# Altium schematic sheet PiAndServos.SchDoc (part 2 of 5)
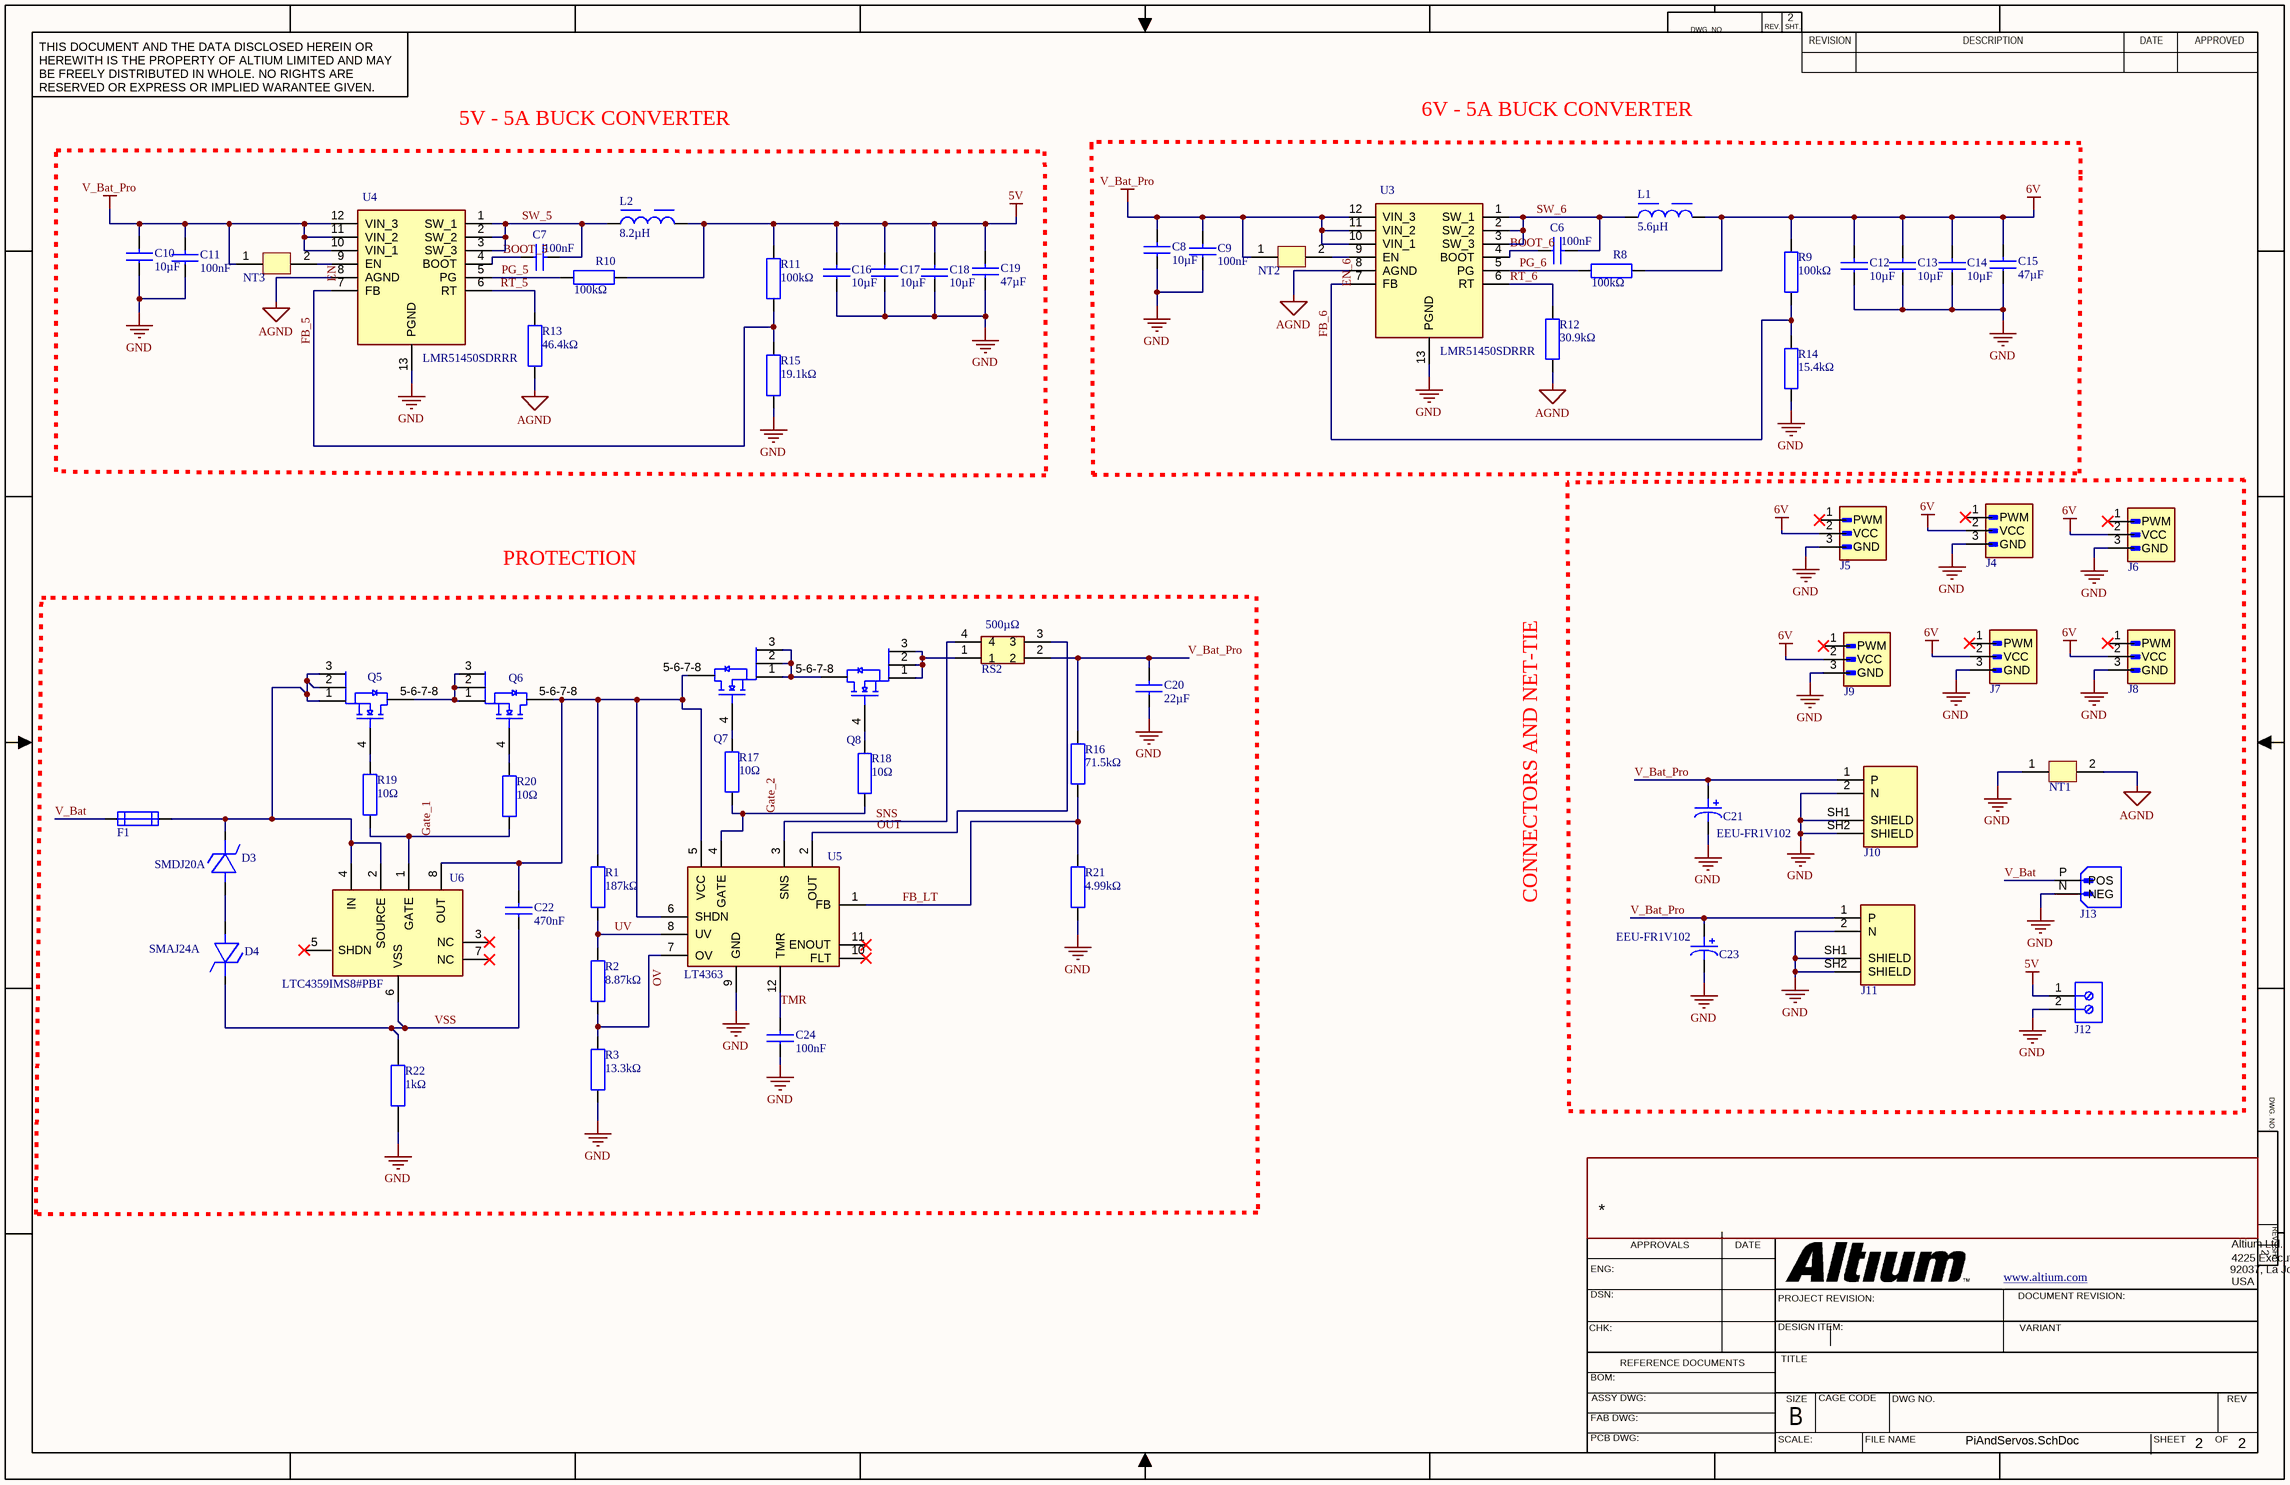
[diagram p1: PiAndServos.SchDoc]
## Library data of the parts
C6 C7 C24 = GRM155R71C104KA88D: 16V 100nF X7R ±10% 0402 Multilayer Ceramic Capacitors MLCC - SMD/SMT ROHS; Manufacturer: Murata; Manufacturer Lifecycle Status: NRND; Insulation Resistance: 10GΩ; Supplier: Future Electronics; Supplier Part Number: GRM155R71C104KA88D; Manufacturer Part Number: GRM155R71C104KA88D; RoHS: Compliant; Category: Ceramic Capacitors; Stock: 9240000; Pricing: 20000=0,001, 50000=0,001, 200000=0,0009, 500000=0,0009, 1250000=0,0009 (USD); Case/Package: 0402; Case Code (Imperial): 0402; Case Code (Metric): 1005; Country of Origin: Japan, Mainland China, Philippines, Singapore, Thailand; Depth: 500µm; Dielectric: X7R; Dielectric Material: Ceramic; Export Control Classification Number (ECCN) Code: EAR99; Height: 500µm; Harmonized Tariff Schedule (HTS) Code: 8532.24.00.20; Introduction Date: 2004-11-19; Lead Free: Lead Free; Length: 1mm; Lifecycle Status: NRND; Material: Ceramic; Max Operating Temperature: 125°C; Min Operating Temperature: -55°C; Mounting Technology: Surface Mount; Pins: 2; Number of Terminals: 2; Packaging: Cut Tape; Radiation Hardening: No; REACH SVHC: Yes; Schedule B: 8532240020, 8532240020|8532240020|8532240020|8532240020|8532240020|8532240020|8532240020|8532240020|8532240020|8532240020|8532240020|8532240020|8532240020, 8532240020|8532240020|8532240020|8532240020|8532240020|8532240020|8532240020|8532240020|8532240020|8532240020|8532240020|8532240020|8532240020|8532240020, 8532240020|8532240020|8532240020|8532240020|8532240020|8532240020|8532240020|8532240020|8532240020|8532240020|8532240020|8532240020|8532240020|8532240020|8532240020; Termination: SMD/SMT; Thickness: 500µm; Tolerance: 10%; Voltage: 16V; Voltage Rating: 16V; Voltage Rating (DC): 16V; Width: 500µm; ComponentLink1URL: https://datasheet.octopart.com:443/GRM155R71C104KA88D-Murata-datasheet-6387203.pdf?src-supplier=Upverter; ComponentLink1Description: https://datasheet.octopart.com:443/GRM155R71C104KA88D-Murata-datasheet-6387203.pdf?src-supplier=Upverter; ComponentLink2URL: https://datasheet.octopart.com:443/GRM155R71C104KA88D-Murata-datasheet-501912.pdf?src-supplier=Farnell; ComponentLink2Description: https://datasheet.octopart.com:443/GRM155R71C104KA88D-Murata-datasheet-501912.pdf?src-supplier=Farnell; ComponentLink3URL: https://datasheet.octopart.com:443/GRM155R71C104KA88D-Murata-datasheet-62320226.pdf?src-supplier=Farnell; ComponentLink3Description: https://datasheet.octopart.com:443/GRM155R71C104KA88D-Murata-datasheet-62320226.pdf?src-supplier=Farnell; ComponentLink4URL: https://datasheet.octopart.com:443/GRM155R71C104KA88D-Murata-datasheet-514334.pdf?src-supplier=Farnell; ComponentLink4Description: https://datasheet.octopart.com:443/GRM155R71C104KA88D-Murata-datasheet-514334.pdf?src-supplier=Farnell; ComponentLink5URL: https://datasheet.octopart.com:443/GRM155R71C104KA88D-Murata-datasheet-165579666.pdf?src-supplier=TME; ComponentLink5Description: https://datasheet.octopart.com:443/GRM155R71C104KA88D-Murata-datasheet-165579666.pdf?src-supplier=TME; ComponentLink6URL: https://datasheet.octopart.com:443/GRM155R71C104KA88D-Murata-datasheet-81455578.pdf?src-supplier=TME; ComponentLink6Description: https://datasheet.octopart.com:443/GRM155R71C104KA88D-Murata-datasheet-81455578.pdf?src-supplier=TME; ComponentLink7URL: https://datasheet.octopart.com:443/GRM155R71C104KA88D-Murata-datasheet-59876780.pdf?src-supplier=TME; ComponentLink7Description: https://datasheet.octopart.com:443/GRM155R71C104KA88D-Murata-datasheet-59876780.pdf?src-supplier=TME; ComponentLink8URL: https://datasheet.octopart.com:443/GRM155R71C104KA88D-Murata-datasheet-141266224.pdf?src-supplier=Ciiva; ComponentLink8Description: https://datasheet.octopart.com:443/GRM155R71C104KA88D-Murata-datasheet-141266224.pdf?src-supplier=Ciiva; ComponentLink9URL: https://datasheet.octopart.com:443/GRM155R71C104KA88D-Murata-datasheet-140690972.pdf?src-supplier=Ciiva; ComponentLink9Description: https://datasheet.octopart.com:443/GRM155R71C104KA88D-Murata-datasheet-140690972.pdf?src-supplier=Ciiva; ComponentLink10URL: https://datasheet.octopart.com:443/GRM155R71C104KA88D-Murata-datasheet-138740890.pdf?src-supplier=Ciiva; ComponentLink10Description: https://datasheet.octopart.com:443/GRM155R71C104KA88D-Murata-datasheet-138740890.pdf?src-supplier=Ciiva; ComponentLink11URL: https://datasheet.octopart.com:443/GRM155R71C104KA88D-Murata-datasheet-120101189.pdf?src-supplier=Megastar; ComponentLink11Description: https://datasheet.octopart.com:443/GRM155R71C104KA88D-Murata-datasheet-120101189.pdf?src-supplier=Megastar; ComponentLink12URL: https://datasheet.octopart.com:443/GRM155R71C104KA88D-Murata-datasheet-96971104.pdf?src-supplier=Future+Electronics; ComponentLink12Description: https://datasheet.octopart.com:443/GRM155R71C104KA88D-Murata-datasheet-96971104.pdf?src-supplier=Future+Electronics; ComponentLink13URL: https://datasheet.octopart.com:443/GRM155R71C104KA88D-Murata-datasheet-22122223.pdf?src-supplier=Future+Electronics; ComponentLink13Description: https://datasheet.octopart.com:443/GRM155R71C104KA88D-Murata-datasheet-22122223.pdf?src-supplier=Future+Electronics; ComponentLink14URL: https://datasheet.octopart.com:443/GRM155R71C104KA88D-Murata-datasheet-14400564.pdf?src-supplier=Future+Electronics; ComponentLink14Description: https://datasheet.octopart.com:443/GRM155R71C104KA88D-Murata-datasheet-14400564.pdf?src-supplier=Future+Electronics; ComponentLink15URL: https://datasheet.octopart.com:443/GRM155R71C104KA88D-Murata-datasheet-44106293.pdf?src-supplier=Future+Electronics; ComponentLink15Description: https://datasheet.octopart.com:443/GRM155R71C104KA88D-Murata-datasheet-44106293.pdf?src-supplier=Future+Electronics; ComponentLink16URL: https://datasheet.octopart.com/GRM155R71C104KA88D-Murata-datasheet-12515295.pdf; ComponentLink16Description: https://datasheet.octopart.com/GRM155R71C104KA88D-Murata-datasheet-12515295.pdf; ComponentLink17URL: https://datasheet.octopart.com/GRM155R71C104KA88D-Murata-datasheet-12510076.pdf; ComponentLink17Description: https://datasheet.octopart.com/GRM155R71C104KA88D-Murata-datasheet-12510076.pdf; ComponentLink18URL: https://datasheet.octopart.com/GRM155R71C104KA88D-Murata-datasheet-11978611.pdf; ComponentLink18Description: https://datasheet.octopart.com/GRM155R71C104KA88D-Murata-datasheet-11978611.pdf; ComponentLink19URL: https://datasheet.octopart.com/GRM155R71C104KA88D-Murata-datasheet-10025737.pdf; ComponentLink19Description: https://datasheet.octopart.com/GRM155R71C104KA88D-Murata-datasheet-10025737.pdf; ComponentLink20URL: https://datasheet.octopart.com/GRM155R71C104KA88D-Murata-datasheet-8819587.pdf; ComponentLink20Description: https://datasheet.octopart.com/GRM155R71C104KA88D-Murata-datasheet-8819587.pdf; ComponentLink21URL: https://datasheet.octopart.com/GRM155R71C104KA88D-Murata-datasheet-12555248.pdf; ComponentLink21Description: https://datasheet.octopart.com/GRM155R71C104KA88D-Murata-datasheet-12555248.pdf; ComponentLink22URL: https://datasheet.octopart.com:443/GRM155R71C104KA88D-Murata-datasheet-11864723.pdf?src-supplier=Arrow+Electronics; ComponentLink22Description: https://datasheet.octopart.com:443/GRM155R71C104KA88D-Murata-datasheet-11864723.pdf?src-supplier=Arrow+Electronics; ComponentLink23URL: https://datasheet.octopart.com:443/GRM155R71C104KA88D-Murata-datasheet-148211.pdf?src-supplier=Garrett; ComponentLink23Description: https://datasheet.octopart.com:443/GRM155R71C104KA88D-Murata-datasheet-148211.pdf?src-supplier=Garrett; ComponentLink24URL: https://datasheet.octopart.com:443/GRM155R71C104KA88D-Murata-datasheet-118811.pdf?src-supplier=DigiKey; ComponentLink24Description: https://datasheet.octopart.com:443/GRM155R71C104KA88D-Murata-datasheet-118811.pdf?src-supplier=DigiKey; ComponentLink25URL: https://datasheet.octopart.com:443/GRM155R71C104KA88D-Murata-datasheet-38265814.pdf?src-supplier=Newark; ComponentLink25Description: https://datasheet.octopart.com:443/GRM155R71C104KA88D-Murata-datasheet-38265814.pdf?src-supplier=Newark; ComponentLink26URL: http://sigma.octopart.com:80/reach_statement/Murata-company-16.pdf?src-supplier=Compliance+Statements; ComponentLink26Description: http://sigma.octopart.com:80/reach_statement/Murata-company-16.pdf?src-supplier=Compliance+Statements
C8 C10 C12-C14 C16-C18 = C3225X7R1H106M250AC: 50V 10uF X7R 卤20% 1210 Multilayer Ceramic Capacitors MLCC - SMD/SMT ROHS; Manufacturer: TDK; Manufacturer Lifecycle Status: PRODUCTION (NOT RECOMMENDED FOR NEW DESIGN); Manufacturer Package Identifier: 1210 (3225 Metric); Tolerance: 20%; Supplier: Arrow Electronics; Supplier Part Number: C3225X7R1H106M250AC; Manufacturer Part Number: C3225X7R1H106M250AC; RoHS: Compliant; Category: Ceramic Capacitors; Stock: 2290; Pricing: 1=0,9803, 10=0,4861, 100=0,4422, 500=0,3574, 1000=0,338, 2000=0,3166 (USD); Case/Package: 1210; Case Code (Imperial): 1210; Case Code (Metric): 3225; China RoHS: Compliant; Country of Origin: Japan; Dielectric: X7R; Dielectric Material: Ceramic; Export Control Classification Number (ECCN) Code: EAR99; Height: 2.5mm; Harmonized Tariff Schedule (HTS) Code: 8532.24.00.20; Introduction Date: 2013-02-27; Lead Free: Lead Free; Length: 3.2mm; Lifecycle Status: NRND; Material: Ceramic; Max Length: 3.6mm; Max Operating Temperature: 125°C; Max Width: 2.8mm; Min Length: 2.8mm; Min Operating Temperature: -55°C; Min Width: 2.2mm; Mounting Technology: Surface Mount; Number of Terminals: 2; REACH SVHC: Yes; Schedule B: 8532240020, 8532240020|8532240020|8532240020|8532240020|8532240020; Termination: SMD/SMT; Voltage Rating: 50V; Voltage Rating (DC): 50V; Weight: 15.989131mg; Width: 2.5mm; ComponentLink1URL: https://datasheet.octopart.com:443/C3225X7R1H106M250AC-TDK-datasheet-175423548.pdf?src-supplier=IHS; ComponentLink1Description: https://datasheet.octopart.com:443/C3225X7R1H106M250AC-TDK-datasheet-175423548.pdf?src-supplier=IHS; ComponentLink2URL: https://sigma.octopart.com:443/138898468/technical_drawing/TDK-C3225X7R1H106M250AC.pdf?src-supplier=Upverter; ComponentLink2Description: https://sigma.octopart.com:443/138898468/technical_drawing/TDK-C3225X7R1H106M250AC.pdf?src-supplier=Upverter; ComponentLink3URL: https://datasheet.octopart.com:443/C3225X7R1H106M250AC-TDK-datasheet-151546523.pdf?src-supplier=TDK; ComponentLink3Description: https://datasheet.octopart.com:443/C3225X7R1H106M250AC-TDK-datasheet-151546523.pdf?src-supplier=TDK; ComponentLink4URL: https://datasheet.octopart.com/C3225X7R1H106M250AC-TDK-datasheet-41194876.pdf; ComponentLink4Description: https://datasheet.octopart.com/C3225X7R1H106M250AC-TDK-datasheet-41194876.pdf; ComponentLink5URL: https://datasheet.octopart.com/C-Series-Ceramic-Chip-Capacitors-TDK-datasheet-family-84.pdf; ComponentLink5Description: https://datasheet.octopart.com/C-Series-Ceramic-Chip-Capacitors-TDK-datasheet-family-84.pdf; ComponentLink6URL: https://datasheet.octopart.com:443/C3225X7R1H106M250AC-TDK-datasheet-82475248.pdf?src-supplier=Newark; ComponentLink6Description: https://datasheet.octopart.com:443/C3225X7R1H106M250AC-TDK-datasheet-82475248.pdf?src-supplier=Newark; ComponentLink7URL: https://datasheet.octopart.com:443/C3225X7R1H106M250AC-TDK-datasheet-14433597.pdf?src-supplier=Future+Electronics; ComponentLink7Description: https://datasheet.octopart.com:443/C3225X7R1H106M250AC-TDK-datasheet-14433597.pdf?src-supplier=Future+Electronics; ComponentLink8URL: http://sigma.octopart.com:80/rohs_certificate/C-Series-Ceramic-Chip-Capacitors-TDK-family-108.pdf?src-supplier=Compliance+Statements; ComponentLink8Description: http://sigma.octopart.com:80/rohs_certificate/C-Series-Ceramic-Chip-Capacitors-TDK-family-108.pdf?src-supplier=Compliance+Statements
C9 C11 = CC0603KRX7R9BB104: Multilayer Ceramic Capacitor, CC Series, 0.1 - F, - 10%, X7R, 50 V, 0603 [1608 Metric]; Manufacturer: Yageo Group; Voltage: 50V; Supplier: Farnell; Supplier Part Number: CC0603KRX7R9BB104; Manufacturer Part Number: CC0603KRX7R9BB104; RoHS: Compliant; Category: Ceramic Capacitors; Stock: 1011406; Pricing: 10=0,0259, 100=0,0121, 500=0,0113, 1000=0,0104, 2000=0,0089, 4000=0,0073 (EUR); Case/Package: 0603; Case Code (Imperial): 0603; Case Code (Metric): 1608; China RoHS: Compliant; Country of Origin: Mainland China, Taiwan; Depth: 800µm; Dielectric: X7R; Dielectric Material: Ceramic; Export Control Classification Number (ECCN) Code: EAR99; Halogen Free: Halogen Free; Height: 800µm; Harmonized Tariff Schedule (HTS) Code: 8532.24.00.20; Introduction Date: 2005-08-18; Lead Free: Lead Free; Length: 1.6mm; Lifecycle Status: Production; Material: Ceramic; Max Operating Temperature: 125°C; Min Operating Temperature: -55°C; Mounting Technology: Surface Mount; Pins: 2; Number of Terminals: 2; Radiation Hardening: No; REACH SVHC: Yes; Schedule B: 8532240020, 8532240020|8532240020, 8532240020|8532240020|8532240020, 8532240020|8532240020|8532240020|8532240020; Termination: SMD/SMT; Thickness: 889µm; Tolerance: 10%; Voltage Rating: 50V; Voltage Rating (DC): 50V; Width: 800µm; ComponentLink1URL: https://datasheet.octopart.com:443/CC0603KRX7R9BB104-Yageo-datasheet-177165144.pdf?src-supplier=IHS; ComponentLink1Description: https://datasheet.octopart.com:443/CC0603KRX7R9BB104-Yageo-datasheet-177165144.pdf?src-supplier=IHS; ComponentLink2URL: https://datasheet.octopart.com:443/CC0603KRX7R9BB104-Yageo-datasheet-82288757.pdf?src-supplier=Upverter; ComponentLink2Description: https://datasheet.octopart.com:443/CC0603KRX7R9BB104-Yageo-datasheet-82288757.pdf?src-supplier=Upverter; ComponentLink3URL: https://datasheet.octopart.com:443/CC0603KRX7R9BB104-Yageo-datasheet-68298032.pdf?src-supplier=Upverter; ComponentLink3Description: https://datasheet.octopart.com:443/CC0603KRX7R9BB104-Yageo-datasheet-68298032.pdf?src-supplier=Upverter; ComponentLink4URL: https://datasheet.octopart.com:443/CC0603KRX7R9BB104-Yageo-Group-datasheet-189192896.pdf?src-supplier=Future+Electronics; ComponentLink4Description: https://datasheet.octopart.com:443/CC0603KRX7R9BB104-Yageo-Group-datasheet-189192896.pdf?src-supplier=Future+Electronics; ComponentLink5URL: https://datasheet.octopart.com:443/CC0603KRX7R9BB104-Yageo-datasheet-166511530.pdf?src-supplier=Future+Electronics; ComponentLink5Description: https://datasheet.octopart.com:443/CC0603KRX7R9BB104-Yageo-datasheet-166511530.pdf?src-supplier=Future+Electronics; ComponentLink6URL: https://datasheet.octopart.com:443/CC0603KRX7R9BB104-Yageo-datasheet-137700082.pdf?src-supplier=Future+Electronics; ComponentLink6Description: https://datasheet.octopart.com:443/CC0603KRX7R9BB104-Yageo-datasheet-137700082.pdf?src-supplier=Future+Electronics; ComponentLink7URL: https://datasheet.octopart.com:443/CC0603KRX7R9BB104-Yageo-datasheet-137700084.pdf?src-supplier=Future+Electronics; ComponentLink7Description: https://datasheet.octopart.com:443/CC0603KRX7R9BB104-Yageo-datasheet-137700084.pdf?src-supplier=Future+Electronics; ComponentLink8URL: https://datasheet.octopart.com:443/CC0603KRX7R9BB104-Yageo-datasheet-27626582.pdf?src-supplier=Future+Electronics; ComponentLink8Description: https://datasheet.octopart.com:443/CC0603KRX7R9BB104-Yageo-datasheet-27626582.pdf?src-supplier=Future+Electronics; ComponentLink9URL: https://datasheet.octopart.com:443/CC0603KRX7R9BB104-Yageo-datasheet-15895757.pdf?src-supplier=Future+Electronics; ComponentLink9Description: https://datasheet.octopart.com:443/CC0603KRX7R9BB104-Yageo-datasheet-15895757.pdf?src-supplier=Future+Electronics; ComponentLink10URL: https://datasheet.octopart.com:443/CC0603KRX7R9BB104-Yageo-datasheet-8324192.pdf?src-supplier=Future+Electronics; ComponentLink10Description: https://datasheet.octopart.com:443/CC0603KRX7R9BB104-Yageo-datasheet-8324192.pdf?src-supplier=Future+Electronics; ComponentLink11URL: https://datasheet.octopart.com/CC0603KRX7R9BB104-Yageo-datasheet-10883670.pdf; ComponentLink11Description: https://datasheet.octopart.com/CC0603KRX7R9BB104-Yageo-datasheet-10883670.pdf; ComponentLink12URL: https://datasheet.octopart.com/CC0603KRX7R9BB104-Yageo-datasheet-12526321.pdf; ComponentLink12Description: https://datasheet.octopart.com/CC0603KRX7R9BB104-Yageo-datasheet-12526321.pdf; ComponentLink13URL: https://datasheet.octopart.com:443/CC0603KRX7R9BB104-Yageo-datasheet-181968726.pdf?src-supplier=Newark; ComponentLink13Description: https://datasheet.octopart.com:443/CC0603KRX7R9BB104-Yageo-datasheet-181968726.pdf?src-supplier=Newark; ComponentLink14URL: https://datasheet.octopart.com:443/CC0603KRX7R9BB104-Yageo-datasheet-499490.pdf?src-supplier=Newark; ComponentLink14Description: https://datasheet.octopart.com:443/CC0603KRX7R9BB104-Yageo-datasheet-499490.pdf?src-supplier=Newark; ComponentLink15URL: https://datasheet.octopart.com:443/CC0603KRX7R9BB104-Yageo-datasheet-62336348.pdf?src-supplier=Newark; ComponentLink15Description: https://datasheet.octopart.com:443/CC0603KRX7R9BB104-Yageo-datasheet-62336348.pdf?src-supplier=Newark; ComponentLink16URL: https://datasheet.octopart.com:443/CC0603KRX7R9BB104-Yageo-datasheet-147453679.pdf?src-supplier=Newark; ComponentLink16Description: https://datasheet.octopart.com:443/CC0603KRX7R9BB104-Yageo-datasheet-147453679.pdf?src-supplier=Newark; ComponentLink17URL: https://datasheet.octopart.com:443/CC0603KRX7R9BB104-Yageo-datasheet-151948686.pdf?src-supplier=Farnell; ComponentLink17Description: https://datasheet.octopart.com:443/CC0603KRX7R9BB104-Yageo-datasheet-151948686.pdf?src-supplier=Farnell; ComponentLink18URL: https://datasheet.octopart.com:443/CC0603KRX7R9BB104-Yageo-datasheet-500777.pdf?src-supplier=Farnell; ComponentLink18Description: https://datasheet.octopart.com:443/CC0603KRX7R9BB104-Yageo-datasheet-500777.pdf?src-supplier=Farnell; ComponentLink19URL: https://datasheet.octopart.com:443/CC0603KRX7R9BB104-Yageo-datasheet-178019014.pdf?src-supplier=Burklin+Elektronik; ComponentLink19Description: https://datasheet.octopart.com:443/CC0603KRX7R9BB104-Yageo-datasheet-178019014.pdf?src-supplier=Burklin+Elektronik; ComponentLink20URL: https://datasheet.octopart.com:443/CC0603KRX7R9BB104-Yageo-Group-datasheet-165992755.pdf?src-supplier=ODG+(Origin+Data+Global); ComponentLink20Description: https://datasheet.octopart.com:443/CC0603KRX7R9BB104-Yageo-Group-datasheet-165992755.pdf?src-supplier=ODG+(Origin+Data+Global); ComponentLink21URL: https://datasheet.octopart.com:443/CC0603KRX7R9BB104-Yageo-datasheet-140260305.pdf?src-supplier=SOS+electronic; ComponentLink21Description: https://datasheet.octopart.com:443/CC0603KRX7R9BB104-Yageo-datasheet-140260305.pdf?src-supplier=SOS+electronic; ComponentLink22URL: https://datasheet.octopart.com:443/CC0603KRX7R9BB104-Yageo-datasheet-120101875.pdf?src-supplier=Megastar; ComponentLink22Description: https://datasheet.octopart.com:443/CC0603KRX7R9BB104-Yageo-datasheet-120101875.pdf?src-supplier=Megastar; ComponentLink23URL: https://datasheet.octopart.com:443/CC0603KRX7R9BB104-Yageo-datasheet-8701427.pdf?src-supplier=element14; ComponentLink23Description: https://datasheet.octopart.com:443/CC0603KRX7R9BB104-Yageo-datasheet-8701427.pdf?src-supplier=element14; ComponentLink24URL: https://datasheet.octopart.com:443/CC0603KRX7R9BB104-Yageo-datasheet-5301394.pdf?src-supplier=element14; ComponentLink24Description: https://datasheet.octopart.com:443/CC0603KRX7R9BB104-Yageo-datasheet-5301394.pdf?src-supplier=element14; ComponentLink25URL: https://datasheet.octopart.com:443/CC0603KRX7R9BB104-Yageo-datasheet-17600895.pdf?src-supplier=TME; ComponentLink25Description: https://datasheet.octopart.com:443/CC0603KRX7R9BB104-Yageo-datasheet-17600895.pdf?src-supplier=TME; ComponentLink26URL: http://sigma.octopart.com:80/15889575/rohs_statement/Yageo-CC0603KRX7R9BB104.pdf?src-supplier=Compliance+Statements; ComponentLink26Description: http://sigma.octopart.com:80/15889575/rohs_statement/Yageo-CC0603KRX7R9BB104.pdf?src-supplier=Compliance+Statements; ComponentLink27URL: http://sigma.octopart.com:80/rohs_statement/Surface-Mount-Ceramic-Multilayer-Capacitors%3B-General-Purpose-%26-High-Capacitance-Class-2%2C-X7R-Yageo-family-124.pdf?src-supplier=Compliance+Statements; ComponentLink27Description: http://sigma.octopart.com:80/rohs_statement/Surface-Mount-Ceramic-Multilayer-Capacitors%3B-General-Purpose-%26-High-Capacitance-Class-2%2C-X7R-Yageo-family-124.pdf?src-supplier=Compliance+Statements; ComponentLink28URL: http://sigma.octopart.com:80/reach_statement/Surface-Mount-Ceramic-Multilayer-Capacitors%3B-General-Purpose-%26-High-Capacitance-Class-2%2C-X7R-Yageo-family-125.pdf?src-supplier=Compliance+Statements; ComponentLink28Description: http://sigma.octopart.com:80/reach_statement/Surface-Mount-Ceramic-Multilayer-Capacitors%3B-General-Purpose-%26-High-Capacitance-Class-2%2C-X7R-Yageo-family-125.pdf?src-supplier=Compliance+Statements; ComponentLink29URL: http://sigma.octopart.com:80/conflict_mineral_statement/Yageo-company-3.pdf?src-supplier=Compliance+Statements; ComponentLink29Description: http://sigma.octopart.com:80/conflict_mineral_statement/Yageo-company-3.pdf?src-supplier=Compliance+Statements
C15 C19 = GRM32ER61C476KE15L: 16V 47uF X5R ±10% 1210 Multilayer Ceramic Capacitors MLCC - SMD/SMT ROHS; Manufacturer: Murata; Manufacturer Lifecycle Status: NRND; Manufacturer Package Identifier: 1210 (3225 Metric); Supplier: Future Electronics; Supplier Part Number: GRM32ER61C476KE15L; Manufacturer Part Number: GRM32ER61C476KE15L; RoHS: Compliant; Category: Ceramic Capacitors; Stock: 188000; Pricing: 1000=0,0948, 3000=0,0921, 4000=0,0914, 10000=0,0893, 15000=0,0872 (USD); Case/Package: 1210; Case Code (Imperial): 1210; Case Code (Metric): 3225; Depth: 2.5mm; Dielectric: X5R; Dielectric Material: Ceramic; Height: 2.5mm; Lead Free: Lead Free; Length: 3.2mm; Lifecycle Status: NRND; Material: Ceramic; Max Operating Temperature: 85°C; Min Operating Temperature: -55°C; Mounting Technology: Surface Mount; Pins: 2; Number of Terminals: 2; Radiation Hardening: No; REACH SVHC: Yes; Schedule B: 8532240020, 8532240020|8532240020, 8532240020|8532240020|8532240020, 8532240020|8532240020|8532240020|8532240020; Termination: SMD/SMT; Thickness: 2.5mm; Tolerance: 10%; Voltage: 16V; Voltage Rating: 16V; Voltage Rating (DC): 16V; Width: 2.5mm; ComponentLink1URL: https://datasheet.octopart.com:443/GRM32ER61C476KE15L-Murata-datasheet-11893327.pdf?src-supplier=_legacy+Avnet; ComponentLink1Description: https://datasheet.octopart.com:443/GRM32ER61C476KE15L-Murata-datasheet-11893327.pdf?src-supplier=_legacy+Avnet; ComponentLink2URL: https://datasheet.octopart.com:443/GRM32ER61C476KE15L-Murata-datasheet-62317406.pdf?src-supplier=element14+APAC; ComponentLink2Description: https://datasheet.octopart.com:443/GRM32ER61C476KE15L-Murata-datasheet-62317406.pdf?src-supplier=element14+APAC; ComponentLink3URL: https://datasheet.octopart.com:443/GRM32ER61C476KE15L-Murata-datasheet-17853190.pdf?src-supplier=element14+APAC; ComponentLink3Description: https://datasheet.octopart.com:443/GRM32ER61C476KE15L-Murata-datasheet-17853190.pdf?src-supplier=element14+APAC; ComponentLink4URL: https://datasheet.octopart.com:443/GRM32ER61C476KE15L-Murata-datasheet-8817987.pdf?src-supplier=Newark; ComponentLink4Description: https://datasheet.octopart.com:443/GRM32ER61C476KE15L-Murata-datasheet-8817987.pdf?src-supplier=Newark; ComponentLink5URL: https://datasheet.octopart.com:443/GRM32ER61C476KE15L-Murata-datasheet-14403028.pdf?src-supplier=Future+Electronics; ComponentLink5Description: https://datasheet.octopart.com:443/GRM32ER61C476KE15L-Murata-datasheet-14403028.pdf?src-supplier=Future+Electronics; ComponentLink6URL: https://datasheet.octopart.com:443/GRM32ER61C476KE15L-Murata-datasheet-22122223.pdf?src-supplier=Future+Electronics; ComponentLink6Description: https://datasheet.octopart.com:443/GRM32ER61C476KE15L-Murata-datasheet-22122223.pdf?src-supplier=Future+Electronics; ComponentLink7URL: https://datasheet.octopart.com:443/GRM32ER61C476KE15L-Murata-datasheet-44109711.pdf?src-supplier=Future+Electronics; ComponentLink7Description: https://datasheet.octopart.com:443/GRM32ER61C476KE15L-Murata-datasheet-44109711.pdf?src-supplier=Future+Electronics; ComponentLink8URL: https://datasheet.octopart.com:443/GRM32ER61C476KE15L-Murata-datasheet-165579666.pdf?src-supplier=TME; ComponentLink8Description: https://datasheet.octopart.com:443/GRM32ER61C476KE15L-Murata-datasheet-165579666.pdf?src-supplier=TME; ComponentLink9URL: https://datasheet.octopart.com:443/GRM32ER61C476KE15L-Murata-datasheet-59876780.pdf?src-supplier=TME; ComponentLink9Description: https://datasheet.octopart.com:443/GRM32ER61C476KE15L-Murata-datasheet-59876780.pdf?src-supplier=TME; ComponentLink10URL: https://datasheet.octopart.com:443/GRM32ER61C476KE15L-Murata-datasheet-140709622.pdf?src-supplier=Ciiva; ComponentLink10Description: https://datasheet.octopart.com:443/GRM32ER61C476KE15L-Murata-datasheet-140709622.pdf?src-supplier=Ciiva; ComponentLink11URL: https://datasheet.octopart.com:443/GRM32ER61C476KE15L-Murata-datasheet-138747025.pdf?src-supplier=Ciiva; ComponentLink11Description: https://datasheet.octopart.com:443/GRM32ER61C476KE15L-Murata-datasheet-138747025.pdf?src-supplier=Ciiva; ComponentLink12URL: https://datasheet.octopart.com:443/GRM32ER61C476KE15L-Murata-datasheet-102370999.pdf?src-supplier=HQonline; ComponentLink12Description: https://datasheet.octopart.com:443/GRM32ER61C476KE15L-Murata-datasheet-102370999.pdf?src-supplier=HQonline; ComponentLink13URL: https://datasheet.octopart.com:443/GRM32ER61C476KE15L-Murata-datasheet-14047368.pdf?src-supplier=iiiC; ComponentLink13Description: https://datasheet.octopart.com:443/GRM32ER61C476KE15L-Murata-datasheet-14047368.pdf?src-supplier=iiiC; ComponentLink14URL: https://datasheet.octopart.com/GRM32ER61C476KE15L-Murata-datasheet-12515295.pdf; ComponentLink14Description: https://datasheet.octopart.com/GRM32ER61C476KE15L-Murata-datasheet-12515295.pdf; ComponentLink15URL: https://datasheet.octopart.com/GRM32ER61C476KE15L-Murata-datasheet-12510076.pdf; ComponentLink15Description: https://datasheet.octopart.com/GRM32ER61C476KE15L-Murata-datasheet-12510076.pdf; ComponentLink16URL: https://datasheet.octopart.com/GRM32ER61C476KE15L-Murata-datasheet-11978611.pdf; ComponentLink16Description: https://datasheet.octopart.com/GRM32ER61C476KE15L-Murata-datasheet-11978611.pdf; ComponentLink17URL: https://datasheet.octopart.com/GRM32ER61C476KE15L-Murata-datasheet-10025737.pdf; ComponentLink17Description: https://datasheet.octopart.com/GRM32ER61C476KE15L-Murata-datasheet-10025737.pdf; ComponentLink18URL: https://datasheet.octopart.com/GRM32ER61C476KE15L-Murata-datasheet-8819587.pdf; ComponentLink18Description: https://datasheet.octopart.com/GRM32ER61C476KE15L-Murata-datasheet-8819587.pdf; ComponentLink19URL: https://datasheet.octopart.com:443/GRM32ER61C476KE15L.-Murata-datasheet-5332913.pdf?src-supplier=Farnell; ComponentLink19Description: https://datasheet.octopart.com:443/GRM32ER61C476KE15L.-Murata-datasheet-5332913.pdf?src-supplier=Farnell; ComponentLink20URL: http://sigma.octopart.com:80/reach_statement/Murata-company-16.pdf?src-supplier=Compliance+Statements; ComponentLink20Description: http://sigma.octopart.com:80/reach_statement/Murata-company-16.pdf?src-supplier=Compliance+Statements
C20 = C5750X7R1H226M250KB: 50V 22uF X7R 卤20% 2220 Multilayer Ceramic Capacitors MLCC - SMD/SMT ROHS; Manufacturer: TDK; Manufacturer Lifecycle Status: PRODUCTION; Tolerance: 20%; Supplier: Farnell; Supplier Part Number: C5750X7R1H226M250KB; Manufacturer Part Number: C5750X7R1H226M250KB; RoHS: Compliant; Category: Ceramic Capacitors; Stock: 4; Pricing: 1=3,8, 10=2,29, 50=2,23, 100=2,16, 200=2,06, 500=1,96 (EUR); Case/Package: 2220; Case Code (Metric): 5750; China RoHS: Compliant; Dielectric: X7R; Dielectric Material: Ceramic; Export Control Classification Number (ECCN) Code: EAR99; Height: 2.5mm; Harmonized Tariff Schedule (HTS) Code: 8532.24.00.20; Introduction Date: 2019-03-19; Lead Free: Lead Free; Length: 5.7mm; Lifecycle Status: Production; Material: Ceramic; Max Length: 6.1mm; Max Operating Temperature: 125°C; Max Width: 5.4mm; Min Length: 5.3mm; Min Operating Temperature: -55°C; Min Width: 4.6mm; Mounting Technology: Surface Mount; Number of Terminals: 2; REACH SVHC: Yes; Thickness: 2.5mm; Voltage Rating: 50V; Voltage Rating (DC): 50V; Width: 5mm; ComponentLink1URL: https://datasheet.octopart.com:443/C5750X7R1H226M250KB-TDK-datasheet-175423548.pdf?src-supplier=TME; ComponentLink1Description: https://datasheet.octopart.com:443/C5750X7R1H226M250KB-TDK-datasheet-175423548.pdf?src-supplier=TME; ComponentLink2URL: https://datasheet.octopart.com:443/C5750X7R1H226M250KB-TDK-datasheet-68298673.pdf?src-supplier=Upverter; ComponentLink2Description: https://datasheet.octopart.com:443/C5750X7R1H226M250KB-TDK-datasheet-68298673.pdf?src-supplier=Upverter; ComponentLink3URL: https://datasheet.octopart.com:443/C5750X7R1H226M250KB-TDK-datasheet-151546523.pdf?src-supplier=ODG+(Origin+Data+Global); ComponentLink3Description: https://datasheet.octopart.com:443/C5750X7R1H226M250KB-TDK-datasheet-151546523.pdf?src-supplier=ODG+(Origin+Data+Global); ComponentLink4URL: https://datasheet.octopart.com:443/C5750X7R1H226M250KB-TDK-datasheet-154546117.pdf?src-supplier=Farnell; ComponentLink4Description: https://datasheet.octopart.com:443/C5750X7R1H226M250KB-TDK-datasheet-154546117.pdf?src-supplier=Farnell; ComponentLink5URL: https://datasheet.octopart.com/C5750X7R1H226M250KB-TDK-datasheet-41194876.pdf; ComponentLink5Description: https://datasheet.octopart.com/C5750X7R1H226M250KB-TDK-datasheet-41194876.pdf; ComponentLink6URL: https://datasheet.octopart.com/C-Series-Ceramic-Chip-Capacitors-TDK-datasheet-family-84.pdf; ComponentLink6Description: https://datasheet.octopart.com/C-Series-Ceramic-Chip-Capacitors-TDK-datasheet-family-84.pdf; ComponentLink7URL: http://sigma.octopart.com:80/rohs_certificate/C-Series-Ceramic-Chip-Capacitors-TDK-family-108.pdf?src-supplier=Compliance+Statements; ComponentLink7Description: http://sigma.octopart.com:80/rohs_certificate/C-Series-Ceramic-Chip-Capacitors-TDK-family-108.pdf?src-supplier=Compliance+Statements
C21 C23 = EEU-FR1V102: Radial Can ALUMINUM ELECTROLYTIC CAPACITOR FR 35V 1000muF ±20% 0.492Dia 12.50mm; Manufacturer: Panasonic; Manufacturer Part Number: EEUFR1V102; Manufacturer Lifecycle Status: ACTIVE; Part Series: FR-A; Value: 1mF; Dissipation Factor: 12%; ESR (Equivalent Series Resistance): 18mΩ; Lead/Base Style: Straight; Lead Diameter: 600µm; Leakage Current: 350µA; Life (Hours): 10000hours; Polarity: Polar; Ripple Current: 2.6A; Supplier: Farnell; Supplier Part Number: EEUFR1V102; RoHS: Compliant; Category: Aluminum Electrolytic Capacitors; Stock: 26228; Pricing: 1=1,24, 5=0,838, 10=0,55, 25=0,533, 50=0,517, 200=0,5 (EUR); Case/Package: Radial; Contact Plating: Tin; Country of Origin: Malaysia; Diameter: 12.5mm; Export Control Classification Number (ECCN) Code: EAR99; Height: 22mm; Height - Seated (Max): 21.9964mm; Harmonized Tariff Schedule (HTS) Code: 8532.22.00.20; Impedance: 18mΩ; Introduction Date: 2010-12-07; Lead Free: Lead Free; Lead Pitch: 5mm; Length: 20mm; Lifecycle Status: Production; Max Operating Temperature: 105°C; Min Operating Temperature: -40°C; Mounting Technology: PCB, Through Hole; Pins: 2; Number of Terminals: 2; Packaging: Bulk; Radiation Hardening: No; REACH SVHC: Yes; Ripple Current (AC): 2.6A; Schedule B: 8532220020, 8532220020|8532220020|8532220020|8532220020|8532220020|8532220020|8532220020|8532220020|8532220020|8532220020|8532220020|8532220020|8532220020|8532220020|8532220020|8532220020|8532220020|8532220020|8532220020|8532220020|8532220020|8532220020|8532220020|85; Terminal Pitch: 5mm; Termination: Radial; Tolerance: 20%; Voltage: 35V; Voltage Rating: 35V; Voltage Rating (DC): 35V; ComponentLink1URL: https://datasheet.octopart.com:443/EEUFR1V102-Panasonic-datasheet-182101038.pdf?src-supplier=IHS; ComponentLink1Description: https://datasheet.octopart.com:443/EEUFR1V102-Panasonic-datasheet-182101038.pdf?src-supplier=IHS; ComponentLink2URL: https://datasheet.octopart.com:443/EEUFR1V102-Panasonic-datasheet-62330550.pdf?src-supplier=Future+Electronics; ComponentLink2Description: https://datasheet.octopart.com:443/EEUFR1V102-Panasonic-datasheet-62330550.pdf?src-supplier=Future+Electronics; ComponentLink3URL: https://datasheet.octopart.com:443/EEU-FR1V102-Panasonic-datasheet-13267316.pdf?src-supplier=Future+Electronics; ComponentLink3Description: https://datasheet.octopart.com:443/EEU-FR1V102-Panasonic-datasheet-13267316.pdf?src-supplier=Future+Electronics; ComponentLink4URL: https://datasheet.octopart.com:443/EEUFR1V102-Panasonic-datasheet-38939130.pdf?src-supplier=Newark; ComponentLink4Description: https://datasheet.octopart.com:443/EEUFR1V102-Panasonic-datasheet-38939130.pdf?src-supplier=Newark; ComponentLink5URL: https://datasheet.octopart.com:443/EEUFR1V102-Panasonic-datasheet-8814502.pdf?src-supplier=Farnell; ComponentLink5Description: https://datasheet.octopart.com:443/EEUFR1V102-Panasonic-datasheet-8814502.pdf?src-supplier=Farnell; ComponentLink6URL: https://datasheet.octopart.com:443/EEUFR1V102-Panasonic-datasheet-10853509.pdf?src-supplier=Farnell; ComponentLink6Description: https://datasheet.octopart.com:443/EEUFR1V102-Panasonic-datasheet-10853509.pdf?src-supplier=Farnell; ComponentLink7URL: https://datasheet.octopart.com:443/EEUFR1V102-Panasonic-datasheet-12103130.pdf?src-supplier=Farnell; ComponentLink7Description: https://datasheet.octopart.com:443/EEUFR1V102-Panasonic-datasheet-12103130.pdf?src-supplier=Farnell; ComponentLink8URL: https://datasheet.octopart.com:443/EEU-FR1V102-Panasonic-datasheet-154766147.pdf?src-supplier=JRH+Electronics; ComponentLink8Description: https://datasheet.octopart.com:443/EEU-FR1V102-Panasonic-datasheet-154766147.pdf?src-supplier=JRH+Electronics; ComponentLink9URL: https://datasheet.octopart.com:443/EEU-FR1V102-Panasonic-datasheet-27908667.pdf?src-supplier=RS+(Formerly+Allied+Electronics); ComponentLink9Description: https://datasheet.octopart.com:443/EEU-FR1V102-Panasonic-datasheet-27908667.pdf?src-supplier=RS+(Formerly+Allied+Electronics); ComponentLink10URL: https://datasheet.octopart.com:443/EEU-FR1V102-Panasonic-datasheet-56871308.pdf?src-supplier=RS+(Formerly+Allied+Electronics); ComponentLink10Description: https://datasheet.octopart.com:443/EEU-FR1V102-Panasonic-datasheet-56871308.pdf?src-supplier=RS+(Formerly+Allied+Electronics); ComponentLink11URL: https://datasheet.octopart.com:443/EEUFR1V102-Panasonic-datasheet-136348340.pdf?src-supplier=TME; ComponentLink11Description: https://datasheet.octopart.com:443/EEUFR1V102-Panasonic-datasheet-136348340.pdf?src-supplier=TME; ComponentLink12URL: https://datasheet.octopart.com:443/EEUFR1V102-Panasonic-datasheet-137880464.pdf?src-supplier=TME; ComponentLink12Description: https://datasheet.octopart.com:443/EEUFR1V102-Panasonic-datasheet-137880464.pdf?src-supplier=TME; ComponentLink13URL: https://datasheet.octopart.com:443/EEU-FR1V102-Panasonic-datasheet-11552345.pdf?src-supplier=Arrow+Electronics; ComponentLink13Description: https://datasheet.octopart.com:443/EEU-FR1V102-Panasonic-datasheet-11552345.pdf?src-supplier=Arrow+Electronics; ComponentLink14URL: https://datasheet.octopart.com:443/EEUFR1V102-Panasonic-datasheet-8835183.pdf?src-supplier=element14; ComponentLink14Description: https://datasheet.octopart.com:443/EEUFR1V102-Panasonic-datasheet-8835183.pdf?src-supplier=element14; ComponentLink15URL: https://datasheet.octopart.com:443/EEU-FR1V102-Panasonic-datasheet-32589663.pdf?src-supplier=Electro+Sonic; ComponentLink15Description: https://datasheet.octopart.com:443/EEU-FR1V102-Panasonic-datasheet-32589663.pdf?src-supplier=Electro+Sonic
C22 = W3F15C4738AT1F: 0612/0805/1206 Feedthru Ceramic Capacitors 1206 50V 47000pF; Manufacturer: TAIYO YUDEN; Manufacturer Part Number: MCASU168SB7474KTCA01; Current Rating: 300mA; DC Resistance (DCR): 600mΩ; Insulation Resistance: 1GΩ; Number of Circuits: 1; Tolerance: 50%; Supplier: Arrow Electronics; Supplier Part Number: MCASU168SB7474KTCA01; RoHS: Compliant; Category: Ceramic Capacitors; Stock: 471; Pricing: 1=0,0439 (USD); Case/Package: 0603; Dielectric Material: Ceramic; Height: 800µm; Length: 1.6mm; Lifecycle Status: Production; Max Operating Temperature: 125°C; Min Operating Temperature: -55°C; Mounting Technology: Surface Mount; Number of Terminals: 2; Ratings: AEC-Q200; REACH SVHC: Yes; Voltage Rating (DC): 50V; Width: 800µm; ComponentLink1URL: https://datasheet.octopart.com:443/MCASU168SB7474KTCA01-Taiyo-Yuden-datasheet-182118782.pdf?src-supplier=IHS; ComponentLink1Description: https://datasheet.octopart.com:443/MCASU168SB7474KTCA01-Taiyo-Yuden-datasheet-182118782.pdf?src-supplier=IHS; ComponentLink2URL: https://datasheet.octopart.com:443/MCASU168SB7474KTCA01-Taiyo-Yuden-datasheet-176292839.pdf?src-supplier=Future+Electronics; ComponentLink2Description: https://datasheet.octopart.com:443/MCASU168SB7474KTCA01-Taiyo-Yuden-datasheet-176292839.pdf?src-supplier=Future+Electronics; ComponentLink3URL: https://datasheet.octopart.com:443/MCASU168SB7474KTCA01-Taiyo-Yuden-datasheet-182282442.pdf?src-supplier=Future+Electronics; ComponentLink3Description: https://datasheet.octopart.com:443/MCASU168SB7474KTCA01-Taiyo-Yuden-datasheet-182282442.pdf?src-supplier=Future+Electronics; China RoHS: Compliant; Export Control Classification Number (ECCN) Code: EAR99; Harmonized Tariff Schedule (HTS) Code: 8504.50.80.00; Introduction Date: 2002-04-23; Packaging: Tape and Reel; Termination: SMD/SMT; Voltage Rating: 50V; ComponentLink4URL: https://datasheet.octopart.com:443/W3F15C4738AT1F-KYOCERA-AVX-datasheet-159616755.pdf?src-supplier=IHS; ComponentLink4Description: https://datasheet.octopart.com:443/W3F15C4738AT1F-KYOCERA-AVX-datasheet-159616755.pdf?src-supplier=IHS; ComponentLink5URL: https://datasheet.octopart.com:443/W3F15C4738AT1F-AVX-datasheet-159777.pdf?src-supplier=Mouser; ComponentLink5Description: https://datasheet.octopart.com:443/W3F15C4738AT1F-AVX-datasheet-159777.pdf?src-supplier=Mouser; ComponentLink6URL: http://sigma.octopart.com:80/conflict_mineral_statement/AVX-company-34.pdf?src-supplier=Compliance+Statements; ComponentLink6Description: http://sigma.octopart.com:80/conflict_mineral_statement/AVX-company-34.pdf?src-supplier=Compliance+Statements; ComponentLink7URL: http://sigma.octopart.com:80/reach_statement/AVX-company-19.pdf?src-supplier=Compliance+Statements; ComponentLink7Description: http://sigma.octopart.com:80/reach_statement/AVX-company-19.pdf?src-supplier=Compliance+Statements
D3 = SMDJ20A: SMDJ Series 20 V 3000 W Surface Mount Uni-Directional TVS Diode - DO-214AB; Manufacturer: Littelfuse; Breakdown Voltage: 23.35V; Clamping Voltage: 32.4V; Direction: Unidirectional; Leakage Current: 2µA; Max Breakdown Voltage: 24.5V; Max Power Dissipation: 6.5W; Max Surge Current: 92.6A; Min Breakdown Voltage: 22.2V; Number of Channels: 1; Operating Supply Voltage: 20V; Peak Pulse Power: 3kW; Power Line Protection: No; Test Current: 1mA; Supplier: Farnell; Supplier Part Number: SMDJ20A; Manufacturer Part Number: SMDJ20A; RoHS: Compliant; Category: TVS Diodes; Stock: 2450; Pricing: 1=0,585, 10=0,485, 100=0,368, 500=0,347, 1000=0,34 (EUR); China RoHS: Non-Compliant; Composition: Zener; Lead Free: Lead Free; Lifecycle Status: Production; Max Operating Temperature: 150°C; Max Reverse Leakage Current: 2µA; Min Operating Temperature: -65°C; Mounting Technology: Surface Mount; Number of Elements: 1; Pins: 2; Number of Terminals: 2; Number of Unidirectional Channels: 1; Packaging: Cut Tape; Peak Pulse Current: 92.6A; Polarity: Unidirectional; Power Dissipation: 3kW; REACH SVHC: No; Reverse Breakdown Voltage: 22.2V; Reverse Standoff Voltage: 20V; Reverse Voltage: 20V; Schedule B: 8541100080, 8541100080|8541100080|8541100080|8541100080|8541100080; Termination: SMD/SMT; ComponentLink1URL: https://datasheet.octopart.com:443/SMDJ20A-Littelfuse-datasheet-150463583.pdf?src-supplier=Farnell; ComponentLink1Description: https://datasheet.octopart.com:443/SMDJ20A-Littelfuse-datasheet-150463583.pdf?src-supplier=Farnell; ComponentLink2URL: https://datasheet.octopart.com:443/SMDJ20A-Littelfuse-datasheet-63711006.pdf?src-supplier=element14+APAC; ComponentLink2Description: https://datasheet.octopart.com:443/SMDJ20A-Littelfuse-datasheet-63711006.pdf?src-supplier=element14+APAC; ComponentLink3URL: https://datasheet.octopart.com:443/SMDJ20A-Littelfuse-datasheet-23805045.pdf?src-supplier=Future+Electronics; ComponentLink3Description: https://datasheet.octopart.com:443/SMDJ20A-Littelfuse-datasheet-23805045.pdf?src-supplier=Future+Electronics; ComponentLink4URL: https://datasheet.octopart.com:443/SMDJ20A-Littelfuse-datasheet-14434287.pdf?src-supplier=Future+Electronics; ComponentLink4Description: https://datasheet.octopart.com:443/SMDJ20A-Littelfuse-datasheet-14434287.pdf?src-supplier=Future+Electronics; ComponentLink5URL: https://datasheet.octopart.com:443/SMDJ20A-Littelfuse-datasheet-130255154.pdf?src-supplier=Littelfuse+SCT; ComponentLink5Description: https://datasheet.octopart.com:443/SMDJ20A-Littelfuse-datasheet-130255154.pdf?src-supplier=Littelfuse+SCT; ComponentLink6URL: https://datasheet.octopart.com:443/SMDJ20A-Littelfuse-datasheet-10978972.pdf?src-supplier=TME; ComponentLink6Description: https://datasheet.octopart.com:443/SMDJ20A-Littelfuse-datasheet-10978972.pdf?src-supplier=TME; ComponentLink7URL: https://datasheet.octopart.com:443/SMDJ20A-Littelfuse-datasheet-32025630.pdf?src-supplier=Fuses+Unlimited; ComponentLink7Description: https://datasheet.octopart.com:443/SMDJ20A-Littelfuse-datasheet-32025630.pdf?src-supplier=Fuses+Unlimited
D4 = SMAJ24A: SMAJ Series 400 W 24 V Uni-Directional Surface Mount TVS Diode - DO-214AC; Manufacturer: Littelfuse; Breakdown Voltage: 28.1V; Value: 650pF; Clamping Voltage: 38.9V; Direction: Unidirectional; Element Configuration: Single; Forward Voltage: 3.5V; Leakage Current: 1µA; Max Breakdown Voltage: 29.5V; Max Junction Temperature (Tj): 150°C; Max Output current: 10.3A; Max Power Dissipation: 3.3W; Min Breakdown Voltage: 26.7V; Number of Channels: 1; Operating Supply Voltage: 24V; Peak Pulse Power: 400W; Power Line Protection: No; Test Current: 1mA; Supplier: Farnell; Supplier Part Number: SMAJ24A; Manufacturer Part Number: SMAJ24A; RoHS: Compliant; Category: TVS Diodes; Stock: 10000; Pricing: 5000=0,121, 15000=0,106 (EUR); Case/Package: SMA; China RoHS: Non-Compliant; Composition: Zener; Export Control Classification Number (ECCN) Code: EAR99; Height: 2.29mm; Harmonized Tariff Schedule (HTS) Code: 8541.10.00.50; Introduction Date: 2003-11-20; Lead Free: Lead Free; Length: 4.5mm; Lifecycle Status: Production; Max Operating Temperature: 150°C; Max Reverse Leakage Current: 1µA; Max Surge Current: 10.3A; Min Operating Temperature: -65°C; Mounting Technology: Surface Mount; Number of Elements: 1; Pins: 2; Number of Terminals: 2; Number of Unidirectional Channels: 1; Packaging: Tape & Reel; Peak Pulse Current: 10.3A; Peak Reverse Current: 1µA; Polarity: Unidirectional; Power Dissipation: 400W; Power Rating: 400W; Radiation Hardening: No; REACH SVHC: No; Reverse Breakdown Voltage: 26.7V; Reverse Standoff Voltage: 24V; Reverse Voltage: 24V; Schedule B: 8541100080, 8541100080|8541100080|8541100080|8541100080|8541100080; Termination: SMD/SMT; Voltage Rating (DC): 24V; Width: 2.79mm; ComponentLink1URL: https://datasheet.octopart.com:443/SMAJ24A-Littelfuse-datasheet-150463581.pdf?src-supplier=Farnell; ComponentLink1Description: https://datasheet.octopart.com:443/SMAJ24A-Littelfuse-datasheet-150463581.pdf?src-supplier=Farnell; ComponentLink2URL: https://datasheet.octopart.com:443/SMAJ24A-Littelfuse-datasheet-63710798.pdf?src-supplier=element14+APAC; ComponentLink2Description: https://datasheet.octopart.com:443/SMAJ24A-Littelfuse-datasheet-63710798.pdf?src-supplier=element14+APAC; ComponentLink3URL: https://datasheet.octopart.com:443/SMAJ24A-Littelfuse-datasheet-11547152.pdf?src-supplier=element14+APAC; ComponentLink3Description: https://datasheet.octopart.com:443/SMAJ24A-Littelfuse-datasheet-11547152.pdf?src-supplier=element14+APAC; ComponentLink4URL: https://datasheet.octopart.com:443/SMAJ24A-Littelfuse-datasheet-5393952.pdf?src-supplier=element14+APAC; ComponentLink4Description: https://datasheet.octopart.com:443/SMAJ24A-Littelfuse-datasheet-5393952.pdf?src-supplier=element14+APAC; ComponentLink5URL: https://datasheet.octopart.com:443/SMAJ24A-Littelfuse-datasheet-511791.pdf?src-supplier=element14+APAC; ComponentLink5Description: https://datasheet.octopart.com:443/SMAJ24A-Littelfuse-datasheet-511791.pdf?src-supplier=element14+APAC; ComponentLink6URL: https://datasheet.octopart.com:443/SMAJ24A-Littelfuse-datasheet-164649624.pdf?src-supplier=JRH+Electronics; ComponentLink6Description: https://datasheet.octopart.com:443/SMAJ24A-Littelfuse-datasheet-164649624.pdf?src-supplier=JRH+Electronics; ComponentLink7URL: https://datasheet.octopart.com:443/SMAJ24A-Littelfuse-datasheet-38878911.pdf?src-supplier=RS+(Formerly+Allied+Electronics); ComponentLink7Description: https://datasheet.octopart.com:443/SMAJ24A-Littelfuse-datasheet-38878911.pdf?src-supplier=RS+(Formerly+Allied+Electronics); ComponentLink8URL: https://datasheet.octopart.com:443/SMAJ24A-Littelfuse-datasheet-17901671.pdf?src-supplier=Future+Electronics; ComponentLink8Description: https://datasheet.octopart.com:443/SMAJ24A-Littelfuse-datasheet-17901671.pdf?src-supplier=Future+Electronics; ComponentLink9URL: https://datasheet.octopart.com:443/SMAJ24A-Littelfuse-datasheet-1053.pdf?src-supplier=DigiKey; ComponentLink9Description: https://datasheet.octopart.com:443/SMAJ24A-Littelfuse-datasheet-1053.pdf?src-supplier=DigiKey
F1 = SF-3812F6000T-2: SMD Fuse, Fast Acting, 60 A, 250 VAC, 100 VDC, 3812 [10030 Metric], SF-3812F-T; Manufacturer: Bourns; Current Rating: 60A; Value: 900µΩ; Voltage Rating: 250V; Voltage Rating (DC): 100V; Supplier: Farnell; Supplier Part Number: SF-3812F6000T-2; Manufacturer Part Number: SF-3812F6000T-2; RoHS: Compliant; Category: Fuses; Pricing: 5000=2,08 (EUR); Country of Origin: Taiwan; Export Control Classification Number (ECCN) Code: EAR99; Fuse Current: 60A; Height: 3.1mm; Harmonized Tariff Schedule (HTS) Code: 8536.10.00.40; Introduction Date: 2021-05-18; Length: 10.1mm; Lifecycle Status: Production; Max Operating Temperature: 125°C; Min Operating Temperature: -55°C; Mounting Technology: Surface Mount; REACH SVHC: No; Voltage Rating (AC): 250V; ComponentLink1URL: https://datasheet.octopart.com:443/SF-3812F6000T-2-Bourns-datasheet-169981795.pdf?src-supplier=Upverter; ComponentLink1Description: https://datasheet.octopart.com:443/SF-3812F6000T-2-Bourns-datasheet-169981795.pdf?src-supplier=Upverter; ComponentLink2URL: http://sigma.octopart.com:80/conflict_mineral_statement/Bourns-company-36.pdf?src-supplier=Compliance+Statements; ComponentLink2Description: http://sigma.octopart.com:80/conflict_mineral_statement/Bourns-company-36.pdf?src-supplier=Compliance+Statements
J4-J9 = 61300311121: WR-PHD Straight Male, PCB Header, Through Hole, 1 Rows, 3 Contacts, 2.54mm Pitch; Manufacturer: Wurth Elektronik; Manufacturer Lifecycle Status: ACTIVE; Connector Type: Male Pin; Contact Resistance: 20mΩ; Current Rating: 3A; Insulation Resistance: 1GΩ; Number of Contacts: 3; Operating Supply Voltage: 250V; YEOL: 1 = Estimated lifetime > 10 years; Supplier: Farnell; Supplier Part Number: 61300311121; Manufacturer Part Number: 61300311121; RoHS: Compliant; Category: Headers and Wire Housings; Stock: 49425; Pricing: 100=0,0751, 500=0,0705, 1000=0,0659, 2500=0,0646 (EUR); Color: Black; Contact Material: Gold; Contact Mating Length: 5.9944mm; Contact Plating: Gold; Gender: Male; Height: 8.94mm; Lead Free: Lead Free; Lead Pitch: 2.54mm; Length: 7.62mm; Lifecycle Status: Production; Max Operating Temperature: 105°C; Min Operating Temperature: -40°C; Mounting Technology: Through Hole; Pins: 3; Number of Positions: 3; Number of Rows: 1; Orientation: Vertical; Packaging: Bulk; Pitch: 2.54mm; Termination: Solder; Voltage Rating: 250V; ComponentLink1URL: https://datasheet.octopart.com:443/61300311121-Wurth-Elektronik-datasheet-168684096.pdf?src-supplier=Wurth+Elektronik; ComponentLink1Description: https://datasheet.octopart.com:443/61300311121-Wurth-Elektronik-datasheet-168684096.pdf?src-supplier=Wurth+Elektronik; ComponentLink2URL: https://datasheet.octopart.com:443/61300311121-W%C3%BCrth-Elektronik-datasheet-44382959.pdf?src-supplier=Future+Electronics; ComponentLink2Description: https://datasheet.octopart.com:443/61300311121-W%C3%BCrth-Elektronik-datasheet-44382959.pdf?src-supplier=Future+Electronics; ComponentLink3URL: https://datasheet.octopart.com:443/61300311121-W%C3%BCrth-Elektronik-datasheet-149524047.pdf?src-supplier=Farnell; ComponentLink3Description: https://datasheet.octopart.com:443/61300311121-W%C3%BCrth-Elektronik-datasheet-149524047.pdf?src-supplier=Farnell; ComponentLink4URL: https://datasheet.octopart.com:443/61300311121-W%C3%BCrth-Elektronik-datasheet-21154836.pdf?src-supplier=element14+APAC; ComponentLink4Description: https://datasheet.octopart.com:443/61300311121-W%C3%BCrth-Elektronik-datasheet-21154836.pdf?src-supplier=element14+APAC; ComponentLink5URL: https://datasheet.octopart.com/613-003-111-21-W%C3%BCrth-Elektronik-datasheet-134615323.pdf; ComponentLink5Description: https://datasheet.octopart.com/613-003-111-21-W%C3%BCrth-Elektronik-datasheet-134615323.pdf
J10 J11 = XT60PW-M: Manufacturer: Amass; Category: Uncategorized; Color: Yellow; Contact Material: Brass; Manufacturer Part Number: XT60PW-M; Pins: 2